# Altium schematic sheet Interace_PT100.SchDoc
size A4
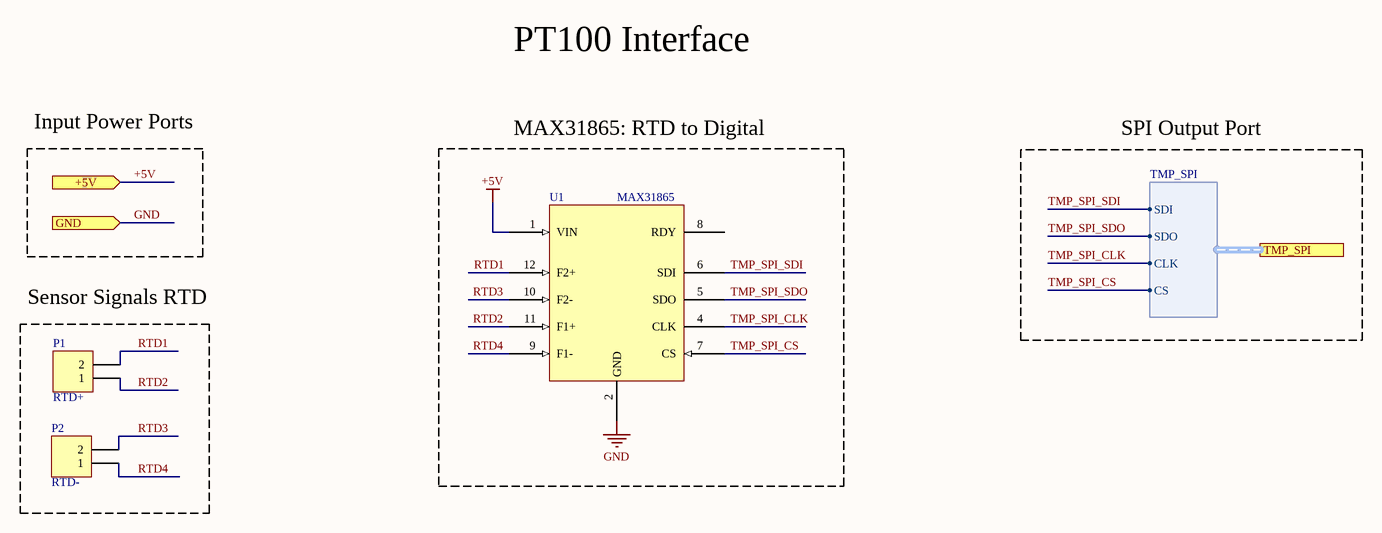
[diagram p0: Interace_PT100.SchDoc]

## Parts
P1  RTD+  [HDR1X2]
P2  RTD-  [HDR1X2]
U1  MAX31865

## Blocks framed on the sheet
MAX31865: RTD to Digital: U1
Sensor Signals RTD: P1 P2

## Ports
+5V (in), GND (in), TMP_SPI (harness TMP_SPI)

## Harnesses
TMP_SPI: SDI, SDO, CLK, CS

## Nets
+5V: U1.1(VIN) ; port +5V
GND: U1.2(GND) ; port GND
RTD1: P1.2 U1.12(F2+)
RTD2: P1.1 U1.11(F1+)
RTD3: P2.2 U1.10(F2-)
RTD4: P2.1 U1.9(F1-)
TMP_SPI_CLK: U1.4(CLK) ; port TMP_SPI.CLK
TMP_SPI_CS: U1.7(CS) ; port TMP_SPI.CS
TMP_SPI_SDI: U1.6(SDI) ; port TMP_SPI.SDI
TMP_SPI_SDO: U1.5(SDO) ; port TMP_SPI.SDO

Not connected (* = marked no-connect by the designer): U1 8(RDY)

## Notes on the sheet
- PT100 Interface
- Input Power Ports
- SPI Output Port

## Library data of the parts
P1 P2 = Header 2: Header, 2-Pin; System: Connector; LatestRevisionDate: 17-Jul-2002; LatestRevisionNote: Re-released for DXP Platform.; Publisher: Altium Limited
U1 = Adafruit MAX31865: Easy-to-use resistance-to-digital converter optimized for platinum resistance temperature detectors (RTDs)